# EAGLE design xc9141-xc9142 (EAGLE 7.7.0)
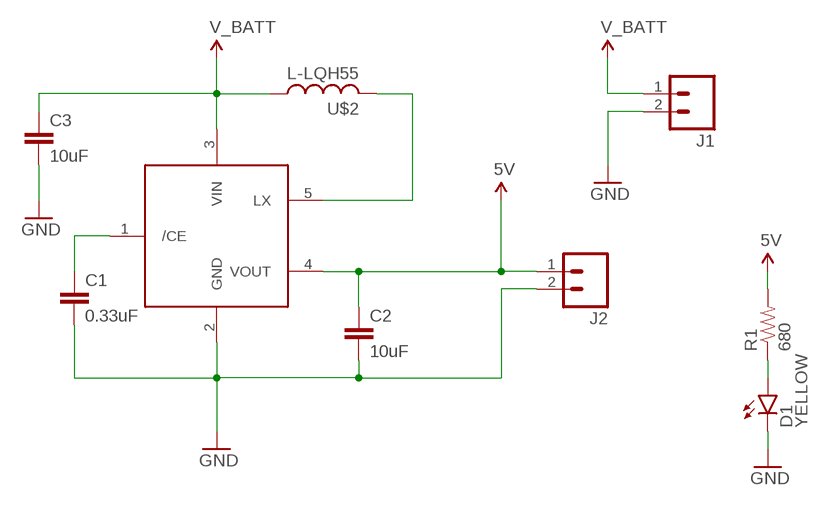
[diagram p0: schematic, sheet 1]

## Parts
C1  0.33uF  0.33UF-50V-10%(0805)  [0805-CAP]
C2  10uF  10UF-6.3V-20%(1206)  [1206]
C3  10uF  10UF-6.3V-20%(1206)  [1206]
D1  YELLOW  LED-YELLOW1206  [LED-1206]
J1  M02JST-PTH-VERT  [JST-2-PTH-VERT]
J2  M02PTH3  [1X02_LONGPADS]
R1  680  0.3OHM-1/8W-1%(0805)  [0805]
U$1  XC9141/XC9142SOT-25  [SOT-25]
U$2  L-LQH55  [LQH55]

## Nets
5V: C2.1 J2.1 R1.2 U$1.4(VOUT)
GND: C1.2 C2.2 C3.2 D1.C J1.2 J2.2 U$1.2(GND)
N$1: D1.A R1.1
N$2: C1.1 U$1.1(/CE)
N$4: U$1.5(LX) U$2.2
V_BATT: C3.1 J1.1 U$1.3(VIN) U$2.1

## Library data of the parts
C1 = SparkFun-Capacitors:0.33UF-50V-10%(0805): CAP-08469; PROD_ID: CAP-08469
C2 C3 = SparkFun-Capacitors:10UF-6.3V-20%(1206): CAP-10057 Ceramic; PROD_ID: CAP-10057
D1 = SparkFun-LED:LED-YELLOW: Yellow SMD LEDs LilyPad 1206- DIO-09909 0603- DIO-09003 "SMART" means more efficient and expensive; PROD_ID: DIO-00820
J1 J2 = SparkFun-Connectors:M02: Standard 2-pin 0.1" header. Use with - straight break away headers ( PRT-00116) - right angle break away headers (PRT-00553) - swiss pins (PRT-00743) - machine pins (PRT-00117) - female headers (PRT-00115) Molex polarized connector foot print use with: PRT-08233 with associated crimp pins and housings. 2.54_SCREWTERM for use with PRT-10571. 3.5mm Screw Terminal footprints for PRT-08084 5mm Screw Terminal footprints for use with PRT-08432
R1 = SparkFun-Resistors:0.3OHM-1/8W-1%(0805): RES-11622; PROD_ID: RES-11622; VALUE: 0.3
U$1 = Synapseware:XC9141/XC9142: XC9141/XC9142 series are synchronous step-up DC/DC converters with a 0.3Ω(TYP.) N-channel driver transistor and a 0.3Ω(TYP.) synchronous P-channel switching transistor built-in.
U$2 = adafruit:L

## Board
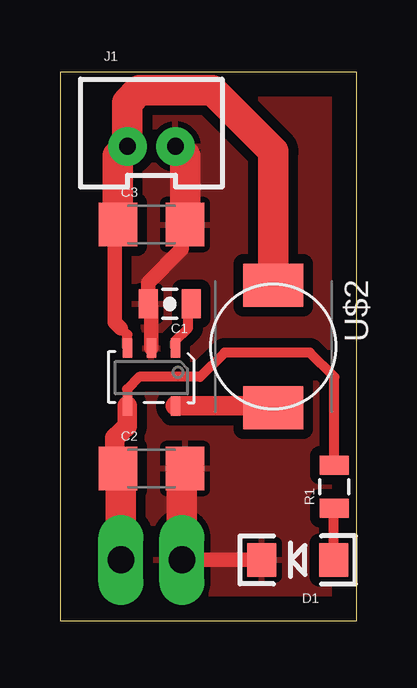
[diagram p1: board, top side]
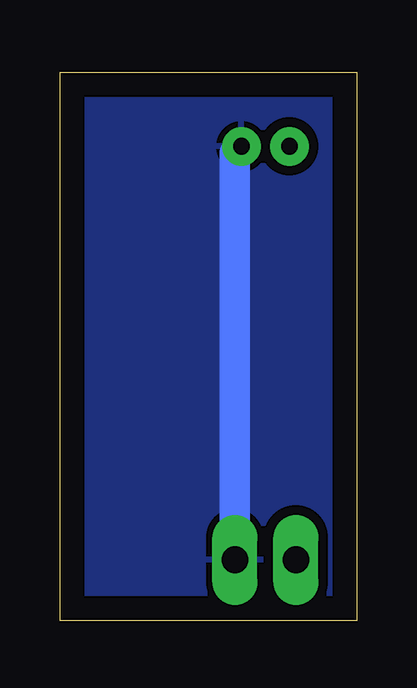
[diagram p2: board, bottom side, seen from below]

Size 12.37 x 22.85 mm. Coordinates in mm from the lower left corner, seen from the top.
Outline: 0,0 12.37,0 12.37,22.85 0,22.85 0,0
Copper layers (1*16): Top 0.035mm / dielectric 1.5mm / Bottom 0.035mm
Design rules "default": minimum track width 10mil, minimum drill 24mil, track to track 8mil, track to pad 8mil, pad to pad 8mil, via to via 8mil, smd to smd 8mil, copper to edge 40mil, drill to drill 8mil, minimum pad ring 10mil, minimum via ring 8mil, stop-mask expansion 4mil, vias tented up to drill 0mil, thermal gap 10mil

### Footprints (pad centres in the part's own frame; a part is rotated, then mirrored left to right if it is on the bottom)
0805-CAP = smd 0.8 x 1.2: 1 -0.9,0; 2 0.9,0
1206 = smd 1.6 x 1.8: 1 -1.4,0; 2 1.4,0
LED-1206 = smd 1.2 x 1.4: A -1.5,0; C 1.5,0
JST-2-PTH-VERT = drill 0.7 pad 1.6: 1 -1,-0.55; 2 1,-0.55
1X02_LONGPADS = drill 1.118 pad 1.88 long: 1 0,0; 2 2.54,0
0805 = smd 0.8 x 1.2: 1 -0.9,0; 2 0.9,0
SOT-25 = smd 0.406 x 0.813: 1 -1,-1.2; 2 0,-1.2; 3 1,-1.2; 4 1,1.2; 5 -1,1.2
LQH55 = smd 1.8 x 2.5: 1 -2.55,0; 2 2.55,0

### Placement (x,y rotation side)
C1  4.57,13.21 180 top
C2  3.81,6.35 0 top
C3  3.81,16.51 0 top
D1  9.91,2.54 180 top
J1  3.81,20.32 0 top
J2  2.54,2.54 0 top
R1  11.43,5.59 90 top
U$1  3.81,10.16 180 top
U$2  8.89,11.43 270 top

### Tracks (layer width: path | path; a pad name or v marks a point on that pad's centre or on a via)
5V
  Top 0.406: R1.2 11.43,10.16 10.41,11.18 6.86,11.18 5.84,10.16 3.3,10.16 2.79,9.65 2.79,8.98 U$1.4
  Top 0.61: 2.29,6.47 C2.1
  Top 0.813: U$1.4 2.81,8.11 2.29,7.62 2.29,6.47
  Top 1.27: J2.1 2.54,6.22 C2.1
GND
  Top 0.406: 3.81,13.07 C1.2
  Top 0.61: U$1.2 3.81,13.07 | C1.2 3.67,14.09 5.08,15.49 5.08,16.38 C3.2 | D1.C J2.2
  Top 1.27: C3.2 5.21,19.37 J1.2 | J2.2 5.08,6.22 C2.2
  Bottom 1.27: J2.2 5.08,19.5 J1.2
  pour Bottom (isolate 0.406): 0,0 12.7,0 12.7,22.86 0,22.86
  pour Top (isolate 0.406): 0,0 12.7,0 12.7,22.86 0,22.86
N$1
  Top 0.406: D1.A 11.41,4.71 R1.1
N$2
  Top 0.406: U$1.1 4.81,11.67 5.33,12.19 5.33,13.07 C1.1
N$4
  Top 0.61: 8.81,8.96 U$2.2
  Top 0.813: U$1.5 8.81,8.96
V_BATT
  Top 0.406: U$1.3 2.81,11.92 2.54,12.19
  Top 0.61: 2.54,12.19 2.29,12.45 2.29,16.39 C3.1
  Top 1.27: C3.1 2.41,19.37 J1.1 2.79,19.79 2.79,21.59 3.3,22.1 6.35,22.1 8.89,19.56 U$2.1